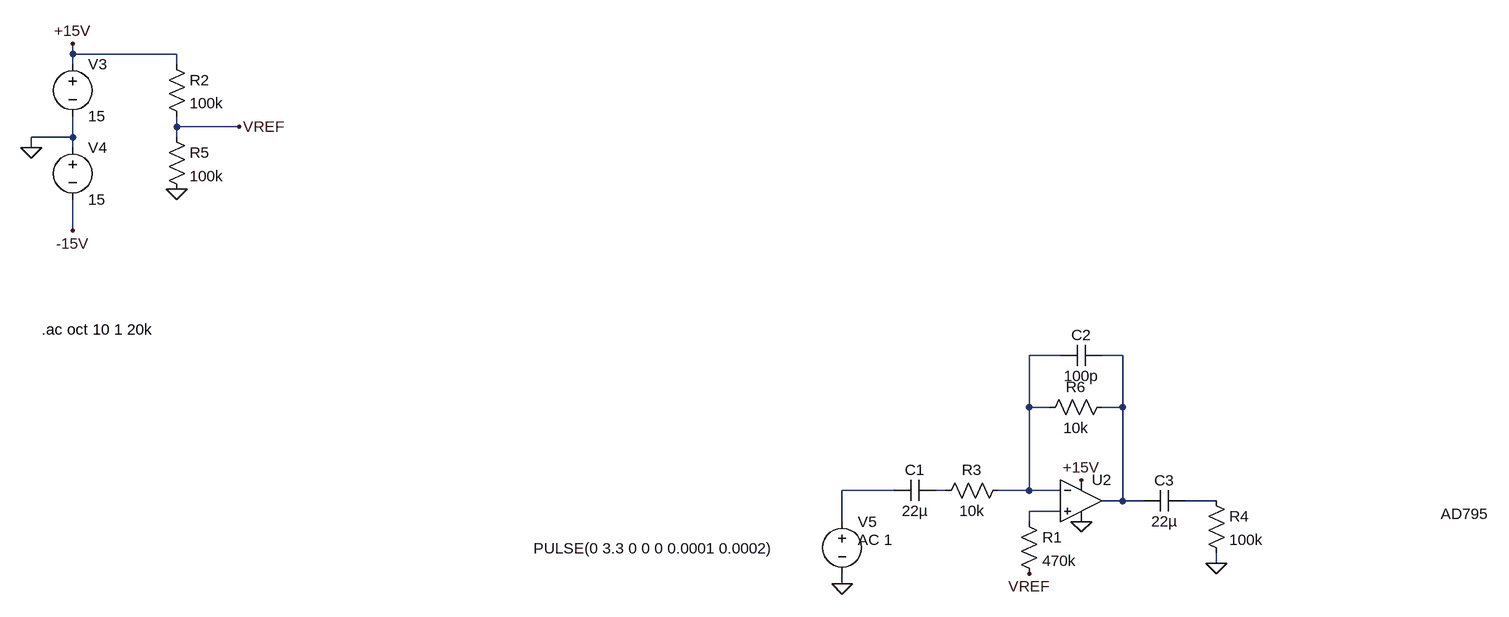
[diagram p0: schematic summing mixer.asc]
summing mixer.asc, the LTspice schematic file:
Version 4
SHEET 1 1688 996
WIRE -496 0 -496 -16
WIRE -336 0 -496 0
WIRE -496 16 -496 0
WIRE -336 16 -336 0
WIRE -336 112 -336 96
WIRE -240 112 -336 112
WIRE -496 128 -496 96
WIRE -496 128 -560 128
WIRE -336 128 -336 112
WIRE -560 144 -560 128
WIRE -496 144 -496 128
WIRE -496 272 -496 224
WIRE 1024 464 976 464
WIRE 1120 464 1088 464
WIRE 976 544 976 464
WIRE 1008 544 976 544
WIRE 1120 544 1120 464
WIRE 1120 544 1088 544
WIRE 768 672 688 672
WIRE 848 672 832 672
WIRE 976 672 976 544
WIRE 976 672 928 672
WIRE 1024 672 976 672
WIRE 1120 688 1120 544
WIRE 1120 688 1088 688
WIRE 1152 688 1120 688
WIRE 1264 688 1216 688
WIRE 1024 704 976 704
WIRE 688 720 688 672
WIRE 976 720 976 704
WIRE 1264 784 1264 768
WIRE 688 816 688 800
FLAG -560 144 0
FLAG -496 -16 +15V
FLAG -496 272 -15V
FLAG 688 816 0
FLAG 1056 656 +15V
FLAG 1264 784 0
FLAG 1056 720 0
FLAG -336 208 0
FLAG -240 112 VREF
FLAG 976 800 VREF
SYMBOL voltage -496 0 R0
WINDOW 123 0 0 Left 0
WINDOW 39 0 0 Left 0
SYMATTR InstName V3
SYMATTR Value 15
SYMBOL voltage -496 128 R0
WINDOW 123 0 0 Left 0
WINDOW 39 0 0 Left 0
SYMATTR InstName V4
SYMATTR Value 15
SYMBOL voltage 688 704 R0
WINDOW 3 -475 57 Left 2
WINDOW 123 24 44 Left 2
WINDOW 39 0 0 Left 0
SYMATTR Value PULSE(0 3.3 0 0 0 0.0001 0.0002)
SYMATTR Value2 AC 1
SYMATTR InstName V5
SYMBOL Opamps\\AD795 1056 624 R0
WINDOW 3 553 84 Left 2
SYMATTR InstName U2
SYMBOL res 1248 672 R0
SYMATTR InstName R4
SYMATTR Value 100k
SYMBOL res 960 704 R0
SYMATTR InstName R1
SYMATTR Value 470k
SYMBOL res -352 0 R0
SYMATTR InstName R2
SYMATTR Value 100k
SYMBOL res -352 112 R0
SYMATTR InstName R5
SYMATTR Value 100k
SYMBOL cap 832 656 R90
WINDOW 0 0 32 VBottom 2
WINDOW 3 32 32 VTop 2
SYMATTR InstName C1
SYMATTR Value 22µ
SYMBOL cap 1216 672 R90
WINDOW 0 0 32 VBottom 2
WINDOW 3 32 32 VTop 2
SYMATTR InstName C3
SYMATTR Value 22µ
SYMBOL res 1104 528 R90
WINDOW 0 0 56 VBottom 2
WINDOW 3 32 56 VTop 2
SYMATTR InstName R6
SYMATTR Value 10k
SYMBOL res 944 656 R90
WINDOW 0 0 56 VBottom 2
WINDOW 3 32 56 VTop 2
SYMATTR InstName R3
SYMATTR Value 10k
SYMBOL cap 1088 448 R90
WINDOW 0 0 32 VBottom 2
WINDOW 3 32 32 VTop 2
SYMATTR InstName C2
SYMATTR Value 100p
TEXT -544 424 Left 2 !.ac oct 10 1 20k

The netlist it stands for:
* summing mixer.asc
V3 +15V 0 15
V4 0 -15V 15
V5 N003 0 PULSE(0 3.3 0 0 0 0.0001 0.0002) AC 1
XU2 N006 N001 +15V 0 N002 AD795  ; pins In+ In- V+ V- OUT
R4 N005 0 100k
R1 N006 VREF 470k
R2 +15V VREF 100k
R5 VREF 0 100k
C1 N004 N003 22µ
C3 N005 N002 22µ
R6 N002 N001 10k
R3 N001 N004 10k
C2 N002 N001 100p
.ac oct 10 1 20k
.lib ADI1.lib
.backanno
.end